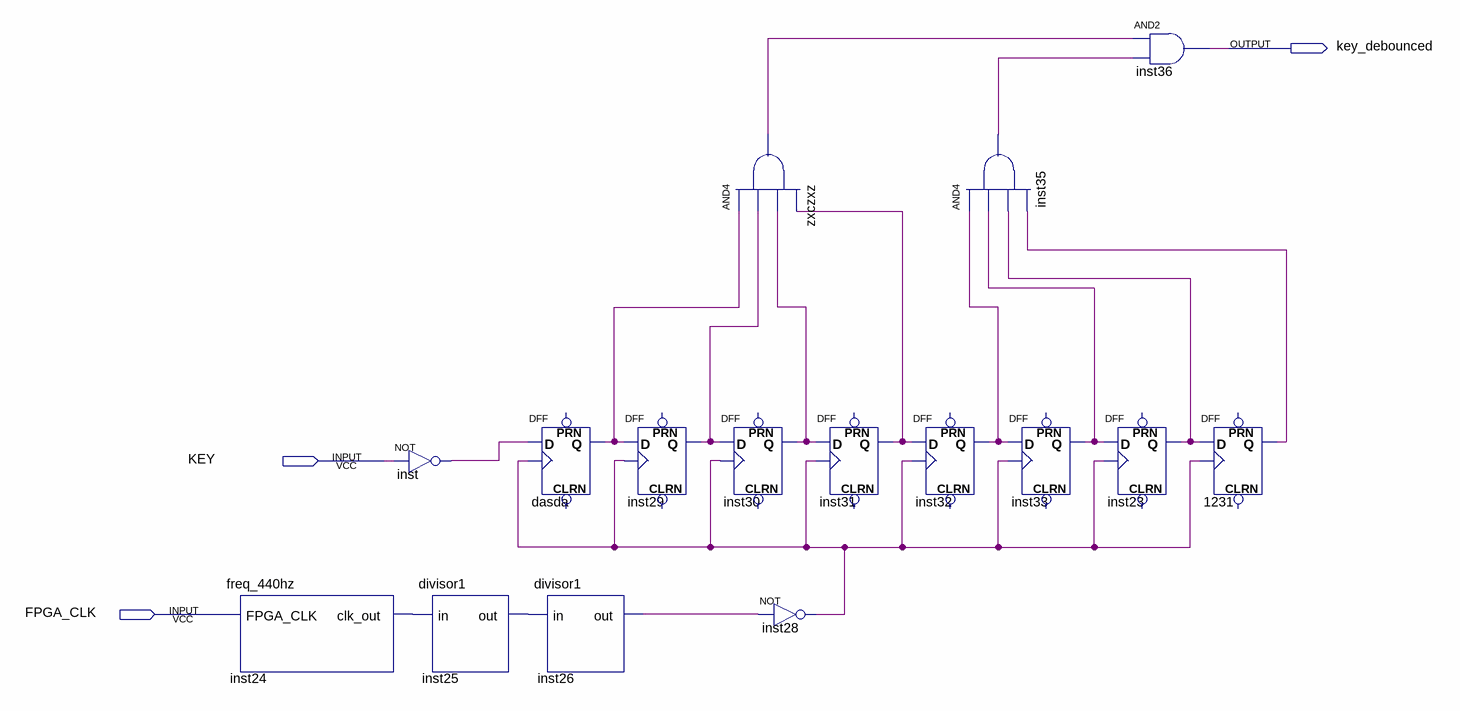
[diagram p0: schematic sheet]
// Quartus schematic key_debouncer.bdf as structural Verilog: 16 symbols, 3 pins
module key_debouncer (
  input  KEY,
  input  FPGA_CLK,
  output key_debounced
);

  wire dasda_q, inst23_q, inst24_clk_out, inst25_out, inst26_out, inst28_out, inst29_q, inst30_q, inst31_q,
       inst32_q, inst33_q, inst35_out, inst_out, n1231_q, zxczxz_out;

  freq_440hz inst24 (.FPGA_CLK(FPGA_CLK), .clk_out(inst24_clk_out));
  not inst (inst_out, KEY);
  divisor1 inst25 (.in(inst24_clk_out), .out(inst25_out));
  DFF dasda (.CLK(inst28_out), .D(inst_out), .Q(dasda_q));  // open: CLRN, PRN
  divisor1 inst26 (.in(inst25_out), .out(inst26_out));
  DFF inst29 (.CLK(inst28_out), .D(dasda_q), .Q(inst29_q));  // open: CLRN, PRN
  and zxczxz (zxczxz_out, dasda_q, inst29_q, inst30_q, inst31_q);
  DFF inst30 (.CLK(inst28_out), .D(inst29_q), .Q(inst30_q));  // open: CLRN, PRN
  not inst28 (inst28_out, inst26_out);
  DFF inst31 (.CLK(inst28_out), .D(inst30_q), .Q(inst31_q));  // open: CLRN, PRN
  and inst35 (inst35_out, inst32_q, inst33_q, inst23_q, n1231_q);
  DFF inst32 (.CLK(inst28_out), .D(inst31_q), .Q(inst32_q));  // open: CLRN, PRN
  DFF inst33 (.CLK(inst28_out), .D(inst32_q), .Q(inst33_q));  // open: CLRN, PRN
  DFF inst23 (.CLK(inst28_out), .D(inst33_q), .Q(inst23_q));  // open: CLRN, PRN
  and inst36 (key_debounced, zxczxz_out, inst35_out);
  DFF u_1231 (.CLK(inst28_out), .D(inst23_q), .Q(n1231_q));  // open: CLRN, PRN
endmodule
